# Altium schematic sheet LB-char-coilHolder.SchDoc
size A
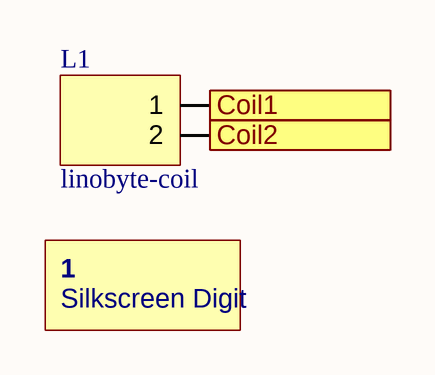
[diagram p0: LB-char-coilHolder.SchDoc]

## Parts
1  Silkscreen Digit  [PCB-7Seg-10mm]
L1  linobyte-coil  [linobyte-coil]

## Ports
Coil1 (out), Coil2 (out)

## Nets
Coil1: L1.1 ; port Coil1
Coil2: L1.2 ; port Coil2

## Library data of the parts
1 = PCB-7Seg